# Altium schematic sheet Fastino_Supply_Switching.SchDoc: Fastino
size 420 x 297 mm; EDA_Number: ARTIQ; Projet: Zotino; Author: G.Kasprowicz; CompanyName: WUT ISE; DrawnBy: G.Kasprowicz; Organization: WUT ISE; Address1: PW ISE; Address2: Nowowiejska 15/19 00-665 Warsaw; Address3: gkasprow@gmail.com; DocumentNumber: 7; Revision: 2; SheetNumber: 4; SheetTotal: 12; ModifiedBy: -; CheckedDate: -; Title2: Power Supply Switching; DivGrp: WUT ISE; Designer: G.Kasprowicz; SPICEModelCacheRGNJYCWR: <root> / <DocumentId>RGNJYCWR</DocumentId> / </root>; ModifiedDate: -; ProjectName: Sensor Box
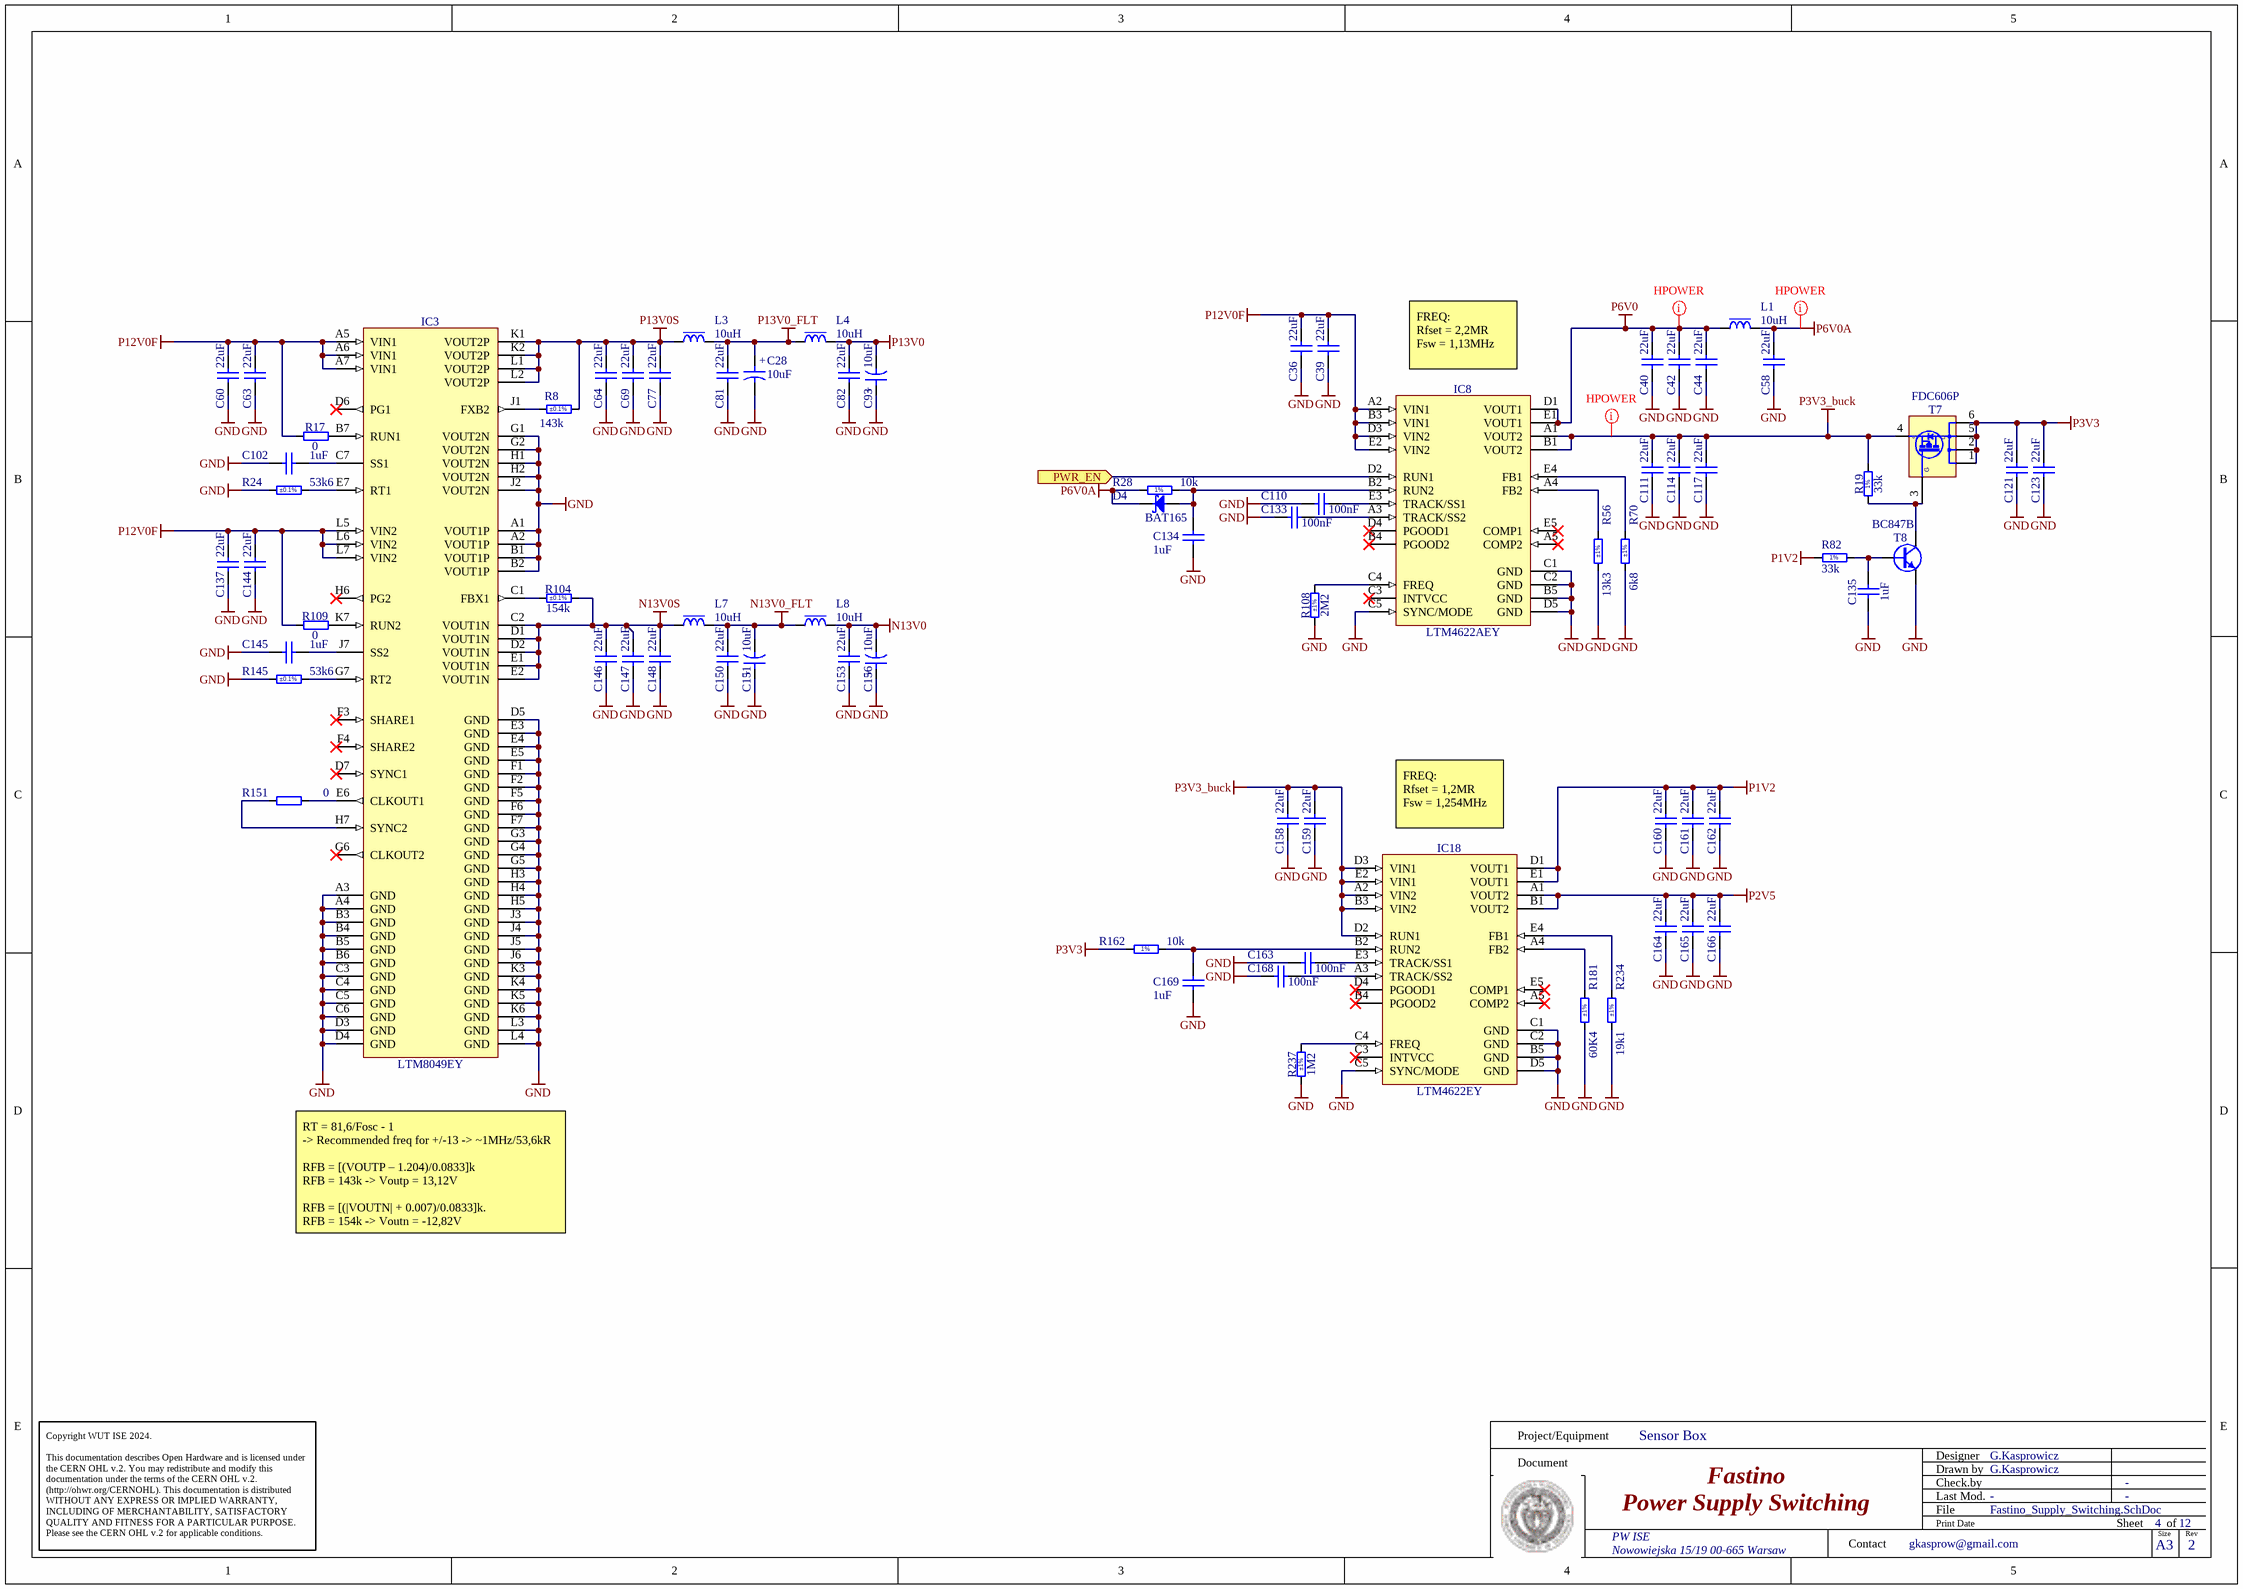
[diagram p0: Fastino_Supply_Switching.SchDoc]

## Parts
C28  10uF  [CAPMP3216X180N]
C36  22uF  [CAPC2012X135N]
C39  22uF  [CAPC2012X135N]
C40  22uF  [CAPC2012X135N]
C42  22uF  [CAPC2012X135N]
C44  22uF  [CAPC2012X135N]
C58  22uF  [CAPC2012X135N]
C60  22uF  [CAPC2012X135N]
C63  22uF  [CAPC2012X135N]
C64  22uF  [CAPC2012X135N]
C69  22uF  [CAPC2012X135N]
C77  22uF  [CAPC2012X135N]
C81  22uF  [CAPC2012X135N]
C82  22uF  [CAPC2012X135N]
C93  10uF  [CAPMP3216X180N]
C102  1uF  [CAPC1608X87N]
C110  100nF  [CAPC1005X55N]
C111  22uF  [CAPC2012X135N]
C114  22uF  [CAPC2012X135N]
C117  22uF  [CAPC2012X135N]
C121  22uF  [CAPC2012X135N]
C123  22uF  [CAPC2012X135N]
C133  100nF  [CAPC1005X55N]
C134  1uF  [CAPC1608X87N]
C135  1uF  [CAPC1608X87N]
C137  22uF  [CAPC2012X135N]
C144  22uF  [CAPC2012X135N]
C145  1uF  [CAPC1608X87N]
C146  22uF  [CAPC2012X135N]
C147  22uF  [CAPC2012X135N]
C148  22uF  [CAPC2012X135N]
C150  22uF  [CAPC2012X135N]
C151  10uF  [CAPMP3216X180N]
C153  22uF  [CAPC2012X135N]
C156  10uF  [CAPMP3216X180N]
C158  22uF  [CAPC2012X135N]
C159  22uF  [CAPC2012X135N]
C160  22uF  [CAPC2012X135N]
C161  22uF  [CAPC2012X135N]
C162  22uF  [CAPC2012X135N]
C163  100nF  [CAPC1005X55N]
C164  22uF  [CAPC2012X135N]
C165  22uF  [CAPC2012X135N]
C166  22uF  [CAPC2012X135N]
C168  100nF  [CAPC1005X55N]
C169  1uF  [CAPC1608X87N]
D4  BAT165  [SOD2512X110N]
IC3  LTM8049EY  [BGA77C127P7X11_900X1500X262]
IC8  LTM4622AEY  [BGA25C127P5X5_625X625X262]
IC18  LTM4622EY  [BGA25C127P5X5_625X625X262]
L1  10uH  [IND_MURATA-PS_8400]
L3  10uH  [IND_MURATA-PS_8400]
L4  10uH  [IND_MURATA-PS_8400]
L7  10uH  [IND_MURATA-PS_8400]
L8  10uH  [IND_MURATA-PS_8400]
R8  143k  Tolerance: ±0.1%  [RESC1608X55N]
R17  0  [RESC1005X40N]
R19  33k  [RESC1005X40N]
R24  53k6  Tolerance: ±0.1%  [RESC1608X55N]
R28  10k  [RESC1005X40N]
R56  13k3  Tolerance: ±1%  [RESC1005X40N]
R70  6k8  Tolerance: ±1%  [RESC1005X40N]
R82  33k  [RESC1005X40N]
R104  154k  Tolerance: ±0.1%  [RESC2012X60N]
R108  2M2  Tolerance: ±1%  [RESC1005X40N]
R109  0  [RESC1005X40N]
R145  53k6  Tolerance: ±0.1%  [RESC1608X55N]
R151  0  [RESC1005X40N]
R162  10k  [RESC1005X40N]
R181  60K4  Tolerance: ±1%  [RESC1005X40N]
R234  19k1  Tolerance: ±1%  [RESC1608X55N]
R237  1M2  Tolerance: ±1%  [RESC1005X40N]
T7  FDC606P  [SOT95P275X110-6N]
T8  BC847B  [SOT95P230X110-3N]

## Ports
PWR_EN (in)

## Nets
GND: C28.2 C36.1 C39.1 C40.1 C42.1 C44.1 C58.1 C60.1 C63.1 C64.1 C69.1 C77.1 C81.1 C82.1 C93.1 C102.2 C110.2 C111.1 C114.1 C117.1 C121.1 C123.1 C133.2 C134.1 C135.1 C137.1 C144.1 C145.2 C146.1 C147.1 C148.1 C150.1 C151.1 C153.1 C156.1 C158.1 C159.1 C160.1 C161.1 C162.1 C163.2 C164.1 C165.1 C166.1 C168.2 C169.1 IC3.A1(VOUT1P) IC3.A2(VOUT1P) IC3.A3(GND) IC3.A4(GND) IC3.B1(VOUT1P) IC3.B2(VOUT1P) IC3.B3(GND) IC3.B4(GND) IC3.B5(GND) IC3.B6(GND) IC3.C3(GND) IC3.C4(GND) IC3.C5(GND) IC3.C6(GND) IC3.D3(GND) IC3.D4(GND) IC3.D5(GND) IC3.E3(GND) IC3.E4(GND) IC3.E5(GND) IC3.F1(GND) IC3.F2(GND) IC3.F5(GND) IC3.F6(GND) IC3.F7(GND) IC3.G1(VOUT2N) IC3.G2(VOUT2N) IC3.G3(GND) IC3.G4(GND) IC3.G5(GND) IC3.H1(VOUT2N) IC3.H2(VOUT2N) IC3.H3(GND) IC3.H4(GND) IC3.H5(GND) IC3.J2(VOUT2N) IC3.J3(GND) IC3.J4(GND) IC3.J5(GND) IC3.J6(GND) IC3.K3(GND) IC3.K4(GND) IC3.K5(GND) IC3.K6(GND) IC3.L3(GND) IC3.L4(GND) IC8.B5(GND) IC8.C1(GND) IC8.C2(GND) IC8.C5(SYNC/MODE) IC8.D5(GND) IC18.B5(GND) IC18.C1(GND) IC18.C2(GND) IC18.C5(SYNC/MODE) IC18.D5(GND) R24.1 R56.1 R70.1 R108.1 R145.1 R181.1 R234.1 R237.1 T8.2(E)
N13V0: C153.2 C156.2 L8.2
N13V0_FLT: C150.2 C151.2 L7.2 L8.1
N13V0S: C146.2 C147.2 C148.2 IC3.C2(VOUT1N) IC3.D1(VOUT1N) IC3.D2(VOUT1N) IC3.E1(VOUT1N) IC3.E2(VOUT1N) L7.1 R104.2
P1V2: C160.2 C161.2 C162.2 IC18.D1(VOUT1) IC18.E1(VOUT1) R82.1
P2V5: C164.2 C165.2 C166.2 IC18.A1(VOUT2) IC18.B1(VOUT2)
P3V3: C121.2 C123.2 R162.1 T7.1(D) T7.2(D) T7.5(D) T7.6(D)
P3V3_buck: C111.2 C114.2 C117.2 C158.2 C159.2 IC8.A1(VOUT2) IC8.B1(VOUT2) IC18.A2(VIN2) IC18.B3(VIN2) IC18.D2(RUN1) IC18.D3(VIN1) IC18.E2(VIN1) R19.2 T7.4(S)
P6V0: C40.2 C42.2 C44.2 IC8.D1(VOUT1) IC8.E1(VOUT1) L1.1
P6V0A: C58.2 D4.1(C) L1.2 R28.1
P12V0F: C36.2 C39.2 C60.2 C63.2 C137.2 C144.2 IC3.A5(VIN1) IC3.A6(VIN1) IC3.A7(VIN1) IC3.L5(VIN2) IC3.L6(VIN2) IC3.L7(VIN2) IC8.A2(VIN1) IC8.B3(VIN1) IC8.D3(VIN2) IC8.E2(VIN2) R17.1 R109.1
P13V0: C82.2 C93.2 L4.2
P13V0_FLT: C28.1 C81.2 L3.2 L4.1
P13V0S: C64.2 C69.2 C77.2 IC3.K1(VOUT2P) IC3.K2(VOUT2P) IC3.L1(VOUT2P) IC3.L2(VOUT2P) L3.1 R8.2
PWR_EN: IC8.D2(RUN1) ; port PWR_EN
NetC102_1: C102.1 IC3.C7(SS1)
NetC110_1: C110.1 IC8.E3(TRACK/SS1)
NetC133_1: C133.1 IC8.A3(TRACK/SS2)
NetC134_2: C134.2 D4.2(A) IC8.B2(RUN2) R28.2
NetC135_2: C135.2 R82.2 T8.1(B)
NetC145_1: C145.1 IC3.J7(SS2)
NetC163_1: C163.1 IC18.E3(TRACK/SS1)
NetC168_1: C168.1 IC18.A3(TRACK/SS2)
NetC169_2: C169.2 IC18.B2(RUN2) R162.2
NetIC3_B7: IC3.B7(RUN1) R17.2
NetIC3_C1: IC3.C1(FBX1) R104.1
NetIC3_E6: IC3.E6(CLKOUT1) R151.2
NetIC3_E7: IC3.E7(RT1) R24.2
NetIC3_G7: IC3.G7(RT2) R145.2
NetIC3_H7: IC3.H7(SYNC2) R151.1
NetIC3_J1: IC3.J1(FXB2) R8.1
NetIC3_K7: IC3.K7(RUN2) R109.2
NetIC8_A4: IC8.A4(FB2) R56.2
NetIC8_C4: IC8.C4(FREQ) R108.2
NetIC8_E4: IC8.E4(FB1) R70.2
NetIC18_A4: IC18.A4(FB2) R181.2
NetIC18_C4: IC18.C4(FREQ) R237.2
NetIC18_E4: IC18.E4(FB1) R234.2
NetR19_1: R19.1 T7.3(S) T8.3(C)

Not connected (* = marked no-connect by the designer): IC3 D6(PG1)* D7(SYNC1)* F3(SHARE1)* F4(SHARE2)* G6(CLKOUT2)* H6(PG2)*; IC8 A5(COMP2)* B4(PGOOD2)* C3(INTVCC)* D4(PGOOD1)* E5(COMP1)*; IC18 A5(COMP2)* B4(PGOOD2)* C3(INTVCC)* D4(PGOOD1)* E5(COMP1)*

## Layout directives
net class Hpower: P3V3_buck, P6V0, P6V0A

## Notes on the sheet
- (near IC8) FREQ:
  Rfset = 2,2MR
  Fsw = 1,13MHz
- (near IC18) FREQ:
  Rfset = 1,2MR
  Fsw = 1,254MHz
- RT = 81,6/Fosc - 1
  -> Recommended freq for +/-13 -> ~1MHz/53,6kR
  RFB = [(VOUTP – 1.204)/0.0833]k
  RFB = 143k -> Voutp = 13,12V
  RFB = [(|VOUTN| + 0.007)/0.0833]k.
  RFB = 154k -> Voutn = -12,82V
- Project/Equipment
- Document
- Designer
- Drawn by
- Check.by
- Copyright WUT ISE 2024.
  This documentation describes Open Hardware and is licensed under the CERN OHL v.2. You may redistribute and modify this documentation under the terms of the CERN OHL v.2. (http://ohwr.org/CERNOHL). This documentation is distributed WITHOUT ANY EXPRESS OR IMPLIED WARRANTY, INCLUDING OF MERCHANTABILITY, SATISFACTORY QUALITY AND FITNESS FOR A PARTICULAR PURPOSE. Please see the CERN OHL v.2 for applicable conditions.
- Contact
- File
- Last Mod.
- Print Date
- Sheet
- Size
- A3
- of
- Rev
- (in symbol CTE3216-18_10UF_16V_20%_AVX_TCJ) +
- (in symbol FDC606P) G
- (in symbol R0402_10K_1%_0.0625W_100PPM) 1%
- (in symbol R0402_33K_1%_0.0625W_100PPM) 1%

## Library data of the parts
C28 C93 C151 C156 = CTE3216-18_10UF_16V_20%_AVX_TCJ: Polarised capacitor; Part Description: ESR 0R200 Tantalum Solid Electrolytic Chip Capacitor with Conductive Polymer Electrode; Manufacturer: AVX; Manufacturer Part Number: TCJA106M016R0200 or  or TR3A106K016C1700; Voltage: 16V; Tolerance: ±20%; Part Number: CTE3216-18_10UF_16V_20%_AVX_TCJ; Component Kind: Standard; Component Type: Standard; Pin Count: 2; Value: 10uF; Status: Preferred; Case: A; Mounted: Yes; Socket: No; SMD: Yes; Sense: No; ComponentHeight: 1.8mm; HelpURL: \\cern.ch\dfs\Applications\Altium\Datasheets\CTE_AVX_TCJ.pdf; Author: CERN DEM JLC; CreateDate: 29.03.2012; LatestRevisionDate: 29.03.2012
C36 C39 C40 C42 C44 C58 C60 C63 C64 C69 C77 C81 C82 C111 C114 C117 C121 C123 C137 C144 C146-C148 C150 C153 C158-C162 C164-C166 = CC0805_22UF_16V_10%_X5R: Non-polarised capacitor; Part Description: SMD Multilayer Chip Ceramic Capacitor; Manufacturer: GENERIC; Manufacturer1 Part Number: C2012X5R1C226KT; Voltage: 16V; TC: X5R; Tolerance: ±10%; Part Number: CC0805_22UF_16V_10%_X5R; Component Kind: Standard; Component Type: Standard; Pin Count: 2; Value: 22uF; Status: Preferred; Manufacturer Part Number: CC0805_22UF_16V_10%_X5R; Case: 0805; Mounted: Yes; Socket: No; SMD: Yes; Sense: No; Manufacturer1 Example: TDK; Manufacturer1 ComponentHeight: 1.35mm; HelpURL: \\cern.ch\dfs\Applications\Altium\Datasheets\CC0805_X5R_TDK_C.pdf; Author: CERN DEM JLC; CreateDate: 25.10.2012; LatestRevisionDate: 25.10.2012
C102 C134 C135 C145 C169 = CC0603_1UF_25V_10%_X7R: Non-polarised capacitor; Part Description: SMD Multilayer Chip Ceramic Capacitor; Manufacturer: GENERIC; Manufacturer1 Part Number: GRM188R71E105KA12D; Voltage: 25V; TC: X7R; Tolerance: ±10%; Part Number: CC0603_1UF_25V_10%_X7R; Component Kind: Standard; Component Type: Standard; Pin Count: 2; Value: 1uF; Status: None; Manufacturer Part Number: CC0603_1UF_25V_10%_X7R; Case: 0603; Mounted: Yes; Socket: No; SMD: Yes; Sense: No; Manufacturer1 Example: MURATA; Manufacturer1 ComponentHeight: 0.9mm; HelpURL: \\cern.ch\dfs\Applications\Altium\Datasheets\CC0603_X7R_MURATA.pdf; Author: CERN DEM JLC; CreateDate: 18.01.2011; LatestRevisionDate: 18.01.2011
C110 C133 C163 C168 = CC0402_100NF_16V_10%_X5R: Non-polarised capacitor; Part Description: SMD Multilayer Chip Ceramic Capacitor; Manufacturer: GENERIC; Manufacturer1 Part Number: GRM155R61C104KA88D; Voltage: 16V; TC: X5R; Tolerance: ±10%; Part Number: CC0402_100NF_16V_10%_X5R; Component Kind: Standard; Component Type: Standard; Pin Count: 2; Value: 100nF; Status: None; Manufacturer Part Number: CC0402_100NF_16V_10%_X5R; Case: 0402; Mounted: Yes; Socket: No; SMD: Yes; Sense: No; Manufacturer1 Example: MURATA; Manufacturer1 ComponentHeight: 0.55mm; HelpURL: \\cern.ch\dfs\Applications\Altium\Datasheets\CC0402_X5R_MURATA_GRM.pdf; Author: CERN DEM JLC; CreateDate: 10.12.2013; LatestRevisionDate: 10.12.2013
D4 = BAT165: Schottky Diode; Manufacturer: INFINEON; Part Description: Medium Power AF Schottky Diode; Voltage: 40V; Power: 750mA; PressFit: No; Bonding: No; Manufacturer Part Number: BAT165; PackageDescription: Small Outline Diode (SOD-323), 1.70mm W X 1.25mm L X 1.10mm H body,  IPC Medium Density; Part Number: BAT165; Component Kind: Standard; Component Type: Standard; Device: BAT165; Pin Count: 2; Case: SOD323; Mounted: Yes; Socket: No; SMD: Yes; Sense: No; ComponentHeight: 1.1mm; HelpURL: \\cern.ch\dfs\Applications\Altium\Datasheets\BAT165.pdf; Author: CERN DEM JLC; CreateDate: 12.11.2014; LatestRevisionDate: 12.11.2014
IC3 = LTM8049EY#PBF: Dual SEPIC or Inverting uModule DC/DC Converter; Manufacturer: LINEAR TECHNOLOGY; PressFit: No; Bonding: No; Part Number: LTM8049EY#PBF; Component Kind: Standard; Component Type: Standard; Device: LTM8049EY; PackageDescription: BGA, 1.27mm Pitch, Rect.; 77 Pin, 7 Columns X 11 Rows, 9.00mm X 15.00mm X 2.62mm H body, IPC Medium Density; Part Description: Dual SEPIC or Inverting uModule DC/DC Converter; Manufacturer Part Number: LTM8049EY; Pin Count: 77; Case: BGA77; Mounted: Yes; Socket: No; SMD: Yes; Sense: No; ComponentHeight: 2.62mm; HelpURL: \\cern.ch\dfs\Applications\Altium\Datasheets\LTM8049EY#PBF.pdf; Author: CERN DEM JLC; CreateDate: 08.12.2016; LatestRevisionDate: 03.02.2022
IC8 = LTM4622AEY#PBF: 3.6V-20V To 1.5V-12V, Dual 2A or Single 4A  Ultrathin Step-Down DC/DC µModule Regulator; Part Description: 3.6V-20V To 1.5V-12V, Dual 2A or Single 4A  Ultrathin Step-Down DC/DC uModule Regulator; Manufacturer: LINEAR TECHNOLOGY; PressFit: No; Bonding: No; Part Number: LTM4622AEY#PBF; Component Kind: Standard; Component Type: Standard; Device: LTM4622AEY; PackageDescription: BGA, 1.27mm Pitch, Square; 25 Pin, 5 Columns X 5 Rows, 6.25mm X 6.25mm X 2.62mm H; Manufacturer Part Number: LTM4622AEY; Pin Count: 25; Case: BGA25; Mounted: Yes; Socket: No; SMD: Yes; Sense: No; ComponentHeight: 2.62mm; HelpURL: \\cern.ch\dfs\Applications\Altium\Datasheets\LTM4622AEY#PBF.pdf; Author: CERN DEM MR; CreateDate: 29.09.2017; LatestRevisionDate: 03.02.2022
IC18 = LTM4622EY: 3.6V-20V To 1.5V-12V, Dual 2A or Single 5A  Ultrathin Step-Down DC/DC µModule Regulator; Part Description: 3.6V-20V To 0.6V-5.5V, Dual 2.5A or Single 5A  Ultrathin Step-Down DC/DC uModule Regulator; Manufacturer: ANALOG DEVICES; PressFit: No; Bonding: No; Part Number: LTM4622EY; Component Kind: Standard; Component Type: Standard; Device: LTM4622EY; PackageDescription: BGA, 1.27mm Pitch, Square; 25 Pin, 5 Columns X 5 Rows, 6.25mm X 6.25mm X 2.62mm H; Manufacturer Part Number: LTM4622EY; Pin Count: 25; Case: BGA25; Mounted: Yes; Socket: No; SMD: Yes; Sense: No; ComponentHeight: 2.62mm; HelpURL: \\cern.ch\dfs\Applications\Altium\Datasheets\LTM4622EY.pdf; Author: CERN DEM HF; CreateDate: 01.12.2021; LatestRevisionDate: 01.12.2021
L1 L3 L4 L7 L8 = IND_10UH_10%_MURATA-PS_8400: Inductor With Core; Part Description: Miniature Surface Mount Power Inductor (8400 Serie); Manufacturer: MURATA POWER SOLUTIONS; Manufacturer Part Number: 84103C; Power: 950mA; Resistance: 0.24R; Tolerance: ±10%; Part Number: IND_10UH_10%_MURATA-PS_8400; Component Kind: Standard; Component Type: Standard; Pin Count: 2; Value: 10uH; Status: None; Mounted: Yes; Socket: No; SMD: Yes; Sense: No; ComponentHeight: 2.9mm; HelpURL: \\cern.ch\dfs\Applications\Altium\Datasheets\IND_MURATA-PS_8400.pdf; Author: CERN DEM JLC; CreateDate: 02.07.2012; LatestRevisionDate: 02.07.2012
R8 = R0603_143K_0.1%_0.063W_10PPM: Resistor - 0.1%; Part Description: Thin Film Chip Resistor; Manufacturer: GENERIC; Manufacturer1 Part Number: RN73C1J143KBTDF; Power: 0.063W; TC: ±10ppm; PressFit: No; Part Number: R0603_143K_0.1%_0.063W_10PPM; Component Kind: Standard; Component Type: Standard; Pin Count: 2; Value: 143k; Status: Not Recommended; Manufacturer Part Number: R0603_143K_0.1%_0.063W_10PPM; Case: 0603; Mounted: Yes; Sense: No; Socket: No; SMD: Yes; Manufacturer1 Example: TYCO HOLSWORTHY; Manufacturer1 ComponentHeight: 0.5mm; HelpURL: \\cern.ch\dfs\Applications\Altium\Datasheets\R0603_Tyco_RN73.pdf; Author: CERN DEM JLC; CreateDate: 03.12.2007; LatestRevisionDate: 13.03.2008
R17 R109 R151 = R0402_0R_JUMPER: Resistor; Part Description: 1A (0.05R Max DC Resistance) Zero Ohm Jumper; Manufacturer: GENERIC; Manufacturer1 Part Number: 232270591001L; Part Number: R0402_0R_JUMPER; Component Kind: Standard; Component Type: Standard; Pin Count: 2; Value: 0; Status: Not recommended; Manufacturer Part Number: R0402_0R_JUMPER; Case: 0402; Mounted: Yes; Sense: No; Socket: No; SMD: Yes; Manufacturer1 Example: YAGEO PHYCOMP; Manufacturer1 ComponentHeight: 0.4mm; HelpURL: \\cern.ch\dfs\Applications\Altium\Datasheets\R0402_Phycomp_RC0402.pdf; Author: CERN DEM JLC; CreateDate: 03.12.2007; LatestRevisionDate: 17.10.2012
R19 R82 = R0402_33K_1%_0.0625W_100PPM: Resistor - 1%; Part Description: General Purpose Thick Film Chip Resistor; Manufacturer: GENERIC; Manufacturer1 Part Number: 232270673303L; TC: ±100ppm/°C; PressFit: No; Part Number: R0402_33K_1%_0.0625W_100PPM; Component Kind: Standard; Component Type: Standard; Pin Count: 2; Value: 33k; Status: Not Recommended; Power: 0.0625W; Tolerance: ±1%; Manufacturer Part Number: R0402_33K_1%_0.0625W_100PPM; Case: 0402; Mounted: Yes; Sense: No; Socket: No; SMD: Yes; Manufacturer1 Example: YAGEO PHYCOMP; Manufacturer1 ComponentHeight: 0.4mm; HelpURL: \\cern.ch\dfs\Applications\Altium\Datasheets\R0402_Phycomp_RC0402.pdf; Author: CERN DEM JLC; CreateDate: 03.12.2007; LatestRevisionDate: 17.10.2012
R24 R145 = R0603_53K6_0.1%_0.063W_10PPM: Resistor - 0.1%; Part Description: Thin Film Chip Resistor; Manufacturer: GENERIC; Manufacturer1 Part Number: RN73C1J53K6BTDF; Power: 0.063W; TC: ±10ppm; PressFit: No; Part Number: R0603_53K6_0.1%_0.063W_10PPM; Component Kind: Standard; Component Type: Standard; Pin Count: 2; Value: 53k6; Status: Not Recommended; Manufacturer Part Number: R0603_53K6_0.1%_0.063W_10PPM; Case: 0603; Mounted: Yes; Sense: No; Socket: No; SMD: Yes; Manufacturer1 Example: TYCO HOLSWORTHY; Manufacturer1 ComponentHeight: 0.5mm; HelpURL: \\cern.ch\dfs\Applications\Altium\Datasheets\R0603_Tyco_RN73.pdf; Author: CERN DEM JLC; CreateDate: 03.12.2007; LatestRevisionDate: 13.03.2008
R28 R162 = R0402_10K_1%_0.0625W_100PPM: Resistor - 1%; Part Description: General Purpose Thick Film Chip Resistor; Manufacturer: GENERIC; Manufacturer1 Part Number: 232270671003L; TC: ±100ppm/°C; PressFit: No; Part Number: R0402_10K_1%_0.0625W_100PPM; Component Kind: Standard; Component Type: Standard; Pin Count: 2; Value: 10k; Status: Not Recommended; Power: 0.0625W; Tolerance: ±1%; Manufacturer Part Number: R0402_10K_1%_0.0625W_100PPM; Case: 0402; Mounted: Yes; Sense: No; Socket: No; SMD: Yes; Manufacturer1 Example: YAGEO PHYCOMP; Manufacturer1 ComponentHeight: 0.4mm; HelpURL: \\cern.ch\dfs\Applications\Altium\Datasheets\R0402_Phycomp_RC0402.pdf; Author: CERN DEM JLC; CreateDate: 03.12.2007; LatestRevisionDate: 17.10.2012
R56 = R0402_13K3_1%_0.0625W_100PPM: Resistor - 1%; Part Description: General Purpose Thick Film Chip Resistor; Manufacturer: GENERIC; Manufacturer1 Part Number: RC0402FR-0713K3L; TC: ±100ppm/°C; PressFit: No; Part Number: R0402_13K3_1%_0.0625W_100PPM; Component Kind: Standard; Component Type: Standard; Pin Count: 2; Value: 13k3; Status: Preferred; Power: 0.0625W; Manufacturer Part Number: R0402_13K3_1%_0.0625W_100PPM; Case: 0402; Mounted: Yes; Sense: No; Socket: No; SMD: Yes; Manufacturer1 Example: YAGEO PHYCOMP; Manufacturer1 ComponentHeight: 0.4mm; HelpURL: \\cern.ch\dfs\Applications\Altium\Datasheets\R0402_YAGEO_RC_L.pdf; Author: CERN DEM BC; CreateDate: 16.03.2021; LatestRevisionDate: 16.03.2021
R70 = R0402_6K8_1%_0.0625W_100PPM: Resistor - 1%; Part Description: General Purpose Thick Film Chip Resistor; Manufacturer: GENERIC; Manufacturer1 Part Number: 232270676802L; TC: ±100ppm/°C; PressFit: No; Part Number: R0402_6K8_1%_0.0625W_100PPM; Component Kind: Standard; Component Type: Standard; Pin Count: 2; Value: 6k8; Status: Not Recommended; Power: 0.0625W; Manufacturer Part Number: R0402_6K8_1%_0.0625W_100PPM; Case: 0402; Mounted: Yes; Sense: No; Socket: No; SMD: Yes; Manufacturer1 Example: YAGEO PHYCOMP; Manufacturer1 ComponentHeight: 0.4mm; HelpURL: \\cern.ch\dfs\Applications\Altium\Datasheets\R0402_Phycomp_RC0402.pdf; Author: CERN DEM JLC; CreateDate: 03.12.2007; LatestRevisionDate: 17.10.2012
R104 = R0805_154K_0.1%_0.1W_25PPM: Resistor - 0.1%; Part Description: Precision Surface Mount Resistor; Manufacturer: GENERIC; Manufacturer1 Part Number: PCF0805R-154KBT1; Power: 0.1W; TC: ±25ppm/°C; PressFit: No; Part Number: R0805_154K_0.1%_0.1W_25PPM; Component Kind: Standard; Component Type: Standard; Pin Count: 2; Value: 154k; Status: Not Recommended; Manufacturer Part Number: R0805_154K_0.1%_0.1W_25PPM; Case: 0805; Mounted: Yes; Sense: No; Socket: No; SMD: Yes; Manufacturer1 Example: TT ELECTRONICS; Manufacturer1 ComponentHeight: 0.65mm; HelpURL: \\cern.ch\dfs\Applications\Altium\Datasheets\R0805_TT ELECTRONICS_PCF.pdf; Author: CERN DEM JLC; CreateDate: 25.10.2018; LatestRevisionDate: 25.10.2018
R108 = R0402_2M2_1%_0.0625W_100PPM: Resistor - 1%; Part Description: General Purpose Thick Film Chip Resistor; Manufacturer: GENERIC; Manufacturer1 Part Number: CRCW04022M20FKED; TC: ±100ppm/°C; PressFit: No; Part Number: R0402_2M2_1%_0.0625W_100PPM; Component Kind: Standard; Component Type: Standard; Pin Count: 2; Value: 2M2; Status: Not Recommended; Power: 0.0625W; Manufacturer Part Number: R0402_2M2_1%_0.0625W_100PPM; Case: 0402; Mounted: Yes; Sense: No; Socket: No; SMD: Yes; Manufacturer1 Example: VISHAY; Manufacturer1 ComponentHeight: 0.4mm; HelpURL: \\cern.ch\dfs\Applications\Altium\Datasheets\R0402_VISHAY_CRCW e3.pdf; Author: CERN DEM JLC; CreateDate: 03.12.2007; LatestRevisionDate: 23.11.2023
R181 = R0402_60K4_1%_0.063W_100PPM: Resistor - 1%; Part Description: General Purpose Thick Film Chip Resistor; Manufacturer: GENERIC; Manufacturer1 Part Number: CRCW040260K4FK; Power: 0.063W; TC: ±100ppm/°C; PressFit: No; Part Number: R0402_60K4_1%_0.063W_100PPM; Component Kind: Standard; Component Type: Standard; Pin Count: 2; Value: 60K4; Status: None; Manufacturer Part Number: R0402_60K4_1%_0.063W_100PPM; Case: 0402; Mounted: Yes; Sense: No; Socket: No; SMD: Yes; Manufacturer1 Example: VISHAY; Manufacturer1 ComponentHeight: 0.4mm; HelpURL: \\cern.ch\dfs\Applications\Altium\Datasheets\R0402_VISHAY_CRCW e3.pdf; Author: CERN DEM BC; CreateDate: 10.01.2020; LatestRevisionDate: 10.01.2020
R234 = R0603_19k1_1%_0.1W_100PPM: Resistor - 1%; Part Description: General Purpose Thick Film Chip Resistor; Manufacturer: GENERIC; Manufacturer1 Part Number: CRCW060319K1FKEA; Power: 0.1W; TC: ±100ppm/°C; PressFit: No; Part Number: R0603_19k1_1%_0.1W_100PPM; Component Kind: Standard; Component Type: Standard; Pin Count: 2; Value: 19k1; Status: Preferred; Manufacturer Part Number: R0603_19k1_1%_0.1W_100PPM; Case: 0603; Mounted: Yes; Sense: No; Socket: No; SMD: Yes; Manufacturer1 Example: VISHAY; Manufacturer1 ComponentHeight: 0.55mm; HelpURL: \\cern.ch\dfs\Applications\Altium\Datasheets\R0603_VISHAY_CRCW e3.pdf; Author: CERN DEM JLC; CreateDate: 15.07.2010; LatestRevisionDate: 11.12.2013
R237 = R0402_1M2_1%_0.0625W_100PPM: Resistor - 1%; Part Description: General Purpose Thick Film Chip Resistor; Manufacturer: GENERIC; Manufacturer1 Part Number: 232270671205L; TC: ±100ppm/°C; PressFit: No; Part Number: R0402_1M2_1%_0.0625W_100PPM; Component Kind: Standard; Component Type: Standard; Pin Count: 2; Value: 1M2; Status: Not Recommended; Power: 0.0625W; Manufacturer Part Number: R0402_1M2_1%_0.0625W_100PPM; Case: 0402; Mounted: Yes; Sense: No; Socket: No; SMD: Yes; Manufacturer1 Example: YAGEO PHYCOMP; Manufacturer1 ComponentHeight: 0.4mm; HelpURL: \\cern.ch\dfs\Applications\Altium\Datasheets\R0402_Phycomp_RC0402.pdf; Author: CERN DEM JLC; CreateDate: 03.12.2007; LatestRevisionDate: 17.10.2012
T7 = FDC606P: P-Channel 1.8V Specified PowerTrench MOSFET; Part Description: -12V -6A P-Channel 1.8V Specified PowerTrench® MOSFET; Manufacturer: ON SEMICONDUCTOR; PressFit: No; Bonding: No; Part Number: FDC606P; Component Kind: Standard; Component Type: Standard; Device: FDC606P; PackageDescription: SOT, 0.95mm Pitch; 6 Pin, 1.50mm W X 2.95mm L X 1.10mm H body, IPC Medium Density; Manufacturer Part Number: FDC606P; Pin Count: 6; Case: SOT23-6; Mounted: Yes; Socket: No; SMD: Yes; Sense: No; ComponentHeight: 1.1mm; HelpURL: \\cern.ch\dfs\Applications\Altium\Datasheets\FDC606P.pdf; Author: CERN DEM HF; CreateDate: 06.10.2021; LatestRevisionDate: 06.10.2021
T8 = BC847B: NPN Transistor; Part Description: 45V 100mA NPN general-purpose transistors; Manufacturer: NXP SEMICONDUCTORS; PressFit: No; Bonding: No; Part Number: BC847B; Component Kind: Standard; Component Type: Standard; Device: BC847B; PackageDescription: SOT23, 3 pin, Pitch 0.95mm - 1.3mm W X 2.9mm L X 1.1mm H, IPC Medium Density; Manufacturer Part Number: BC847B; Pin Count: 3; Case: SOT23-3; Mounted: Yes; Socket: No; SMD: Yes; Sense: No; ComponentHeight: 1.1mm; HelpURL: \\cern.ch\dfs\Applications\Altium\Datasheets\BC847B.pdf; Author: CERN DEM JLC; CreateDate: 14.06.2011; LatestRevisionDate: 14.06.2011